# Altium schematic sheet 02 - LcdGraphic128x64.SchDoc
size A4
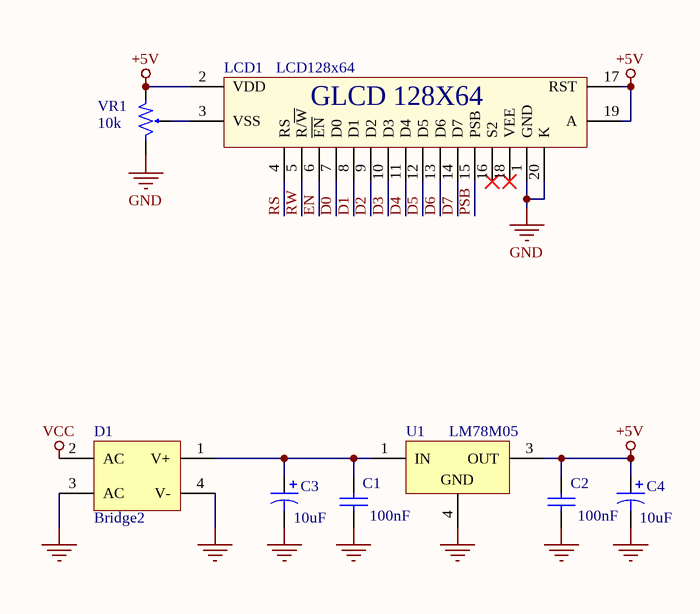
[diagram p0: 02 - LcdGraphic128x64.SchDoc]

## Parts
C1  value 100nF  [RAD-0.3]  (hidden comment: 104)
C2  value 100nF  [RAD-0.3]  (hidden comment: 104)
C3  value 10uF  [RB7.6-15]  (hidden comment: 10uF/16V)
C4  value 10uF  [RB7.6-15]  (hidden comment: 10uF/16V)
D1  Bridge2  [D-46_6A]
LCD1  LCD128x64  [LCD128x64]
U1  value LM78M05  [NDP0003B_M]  (hidden comment: LM78M05CDTX)
VR1  10k  [VR1]

## Nets
+5V: C2.1 C4.1 LCD1.2(VDD) LCD1.17(RST) LCD1.19(A) U1.3(OUT) VR1.1
GND: C1.2 C2.2 C3.2 C4.2 D1.3(AC) D1.4(V-) LCD1.1(GND) LCD1.20(K) U1.4(GND) VR1.3
VCC: D1.2(AC)
D0: LCD1.7(D0)
D1: LCD1.8(D1)
D2: LCD1.9(D2)
D3: LCD1.10(D3)
D4: LCD1.11(D4)
D5: LCD1.12(D5)
D6: LCD1.13(D6)
D7: LCD1.14(D7)
EN: LCD1.6(~{EN})
PSB: LCD1.15(PSB)
RS: LCD1.4(RS)
RW: LCD1.5(R/~{W})
NetC1_1: C1.1 C3.1 D1.1(V+) U1.1(IN)
NetLCD1_3: LCD1.3(VSS) VR1.2

Not connected (* = marked no-connect by the designer): LCD1 16(S2)* 18(VEE)*

## Notes on the sheet
- (in symbol LCD128x64) GLCD 128X64

## Library data of the parts
C1 C2 = Cap: Capacitor; Published: 8-Jun-2000; LatestRevisionDate: 17-Jul-2002; LatestRevisionNote: Re-released for DXP Platform.; PackageReference: RAD-0.3; Publisher: Altium Limited; PackageDescription: Radial Cap, Thru-Hole; 2 Leads; 0.3 in Pin Spacing
C3 C4 = Cap Pol1: Polarized Capacitor (Radial); Published: 8-Jun-2000; LatestRevisionDate: 17-Jul-2002; LatestRevisionNote: Re-released for DXP Platform.; PackageReference: RB7.6-15; Publisher: Altium Limited; PackageDescription: Polarized Capacitor (Radial); 2 Leads
D1 = Bridge2: Diode Bridge; Published: 24-Mar-1999; LatestRevisionDate: 17-Jul-2002; LatestRevisionNote: Re-released for DXP Platform.; PackageReference: D-46_6A; Publisher: Altium Limited; PackageDescription: Bridge Rectifier; 4 Terminals; Body 16.8 x 16.8 mm (typ); Pitch 10.67 mm
LCD1 = LCD128x64: LCD Graphic 128x64; Value: LCD 128x64
U1 = CMP-0062-00204-3: 3-Terminal Positive Voltage Regulators, 3-pin TO-252; Manufacturer: Texas Instruments; PackageTopMarking: NSUZXYTT*LM78M05*CDT; PowerWise: N; CompType: LDO IC; ComponentLink1Description: Datasheet URL; ComponentLink1URL: http://www.ti.com/general/docs/lit/getliterature.tsp?genericPartNumber=LM78M05&fileType=pdf; PackageReference: NDP0003B; Code_JEDEC: TO-252-AA; PinCount: 3; PackageDescription: TO252, Molded, Jedec, 6.8 x 6.10 x 2.30mm Body, 3 Lead, 2.28mm Pitch, Surface Mount
VR1 = VR1: Var Resistor; Value: VR 10K